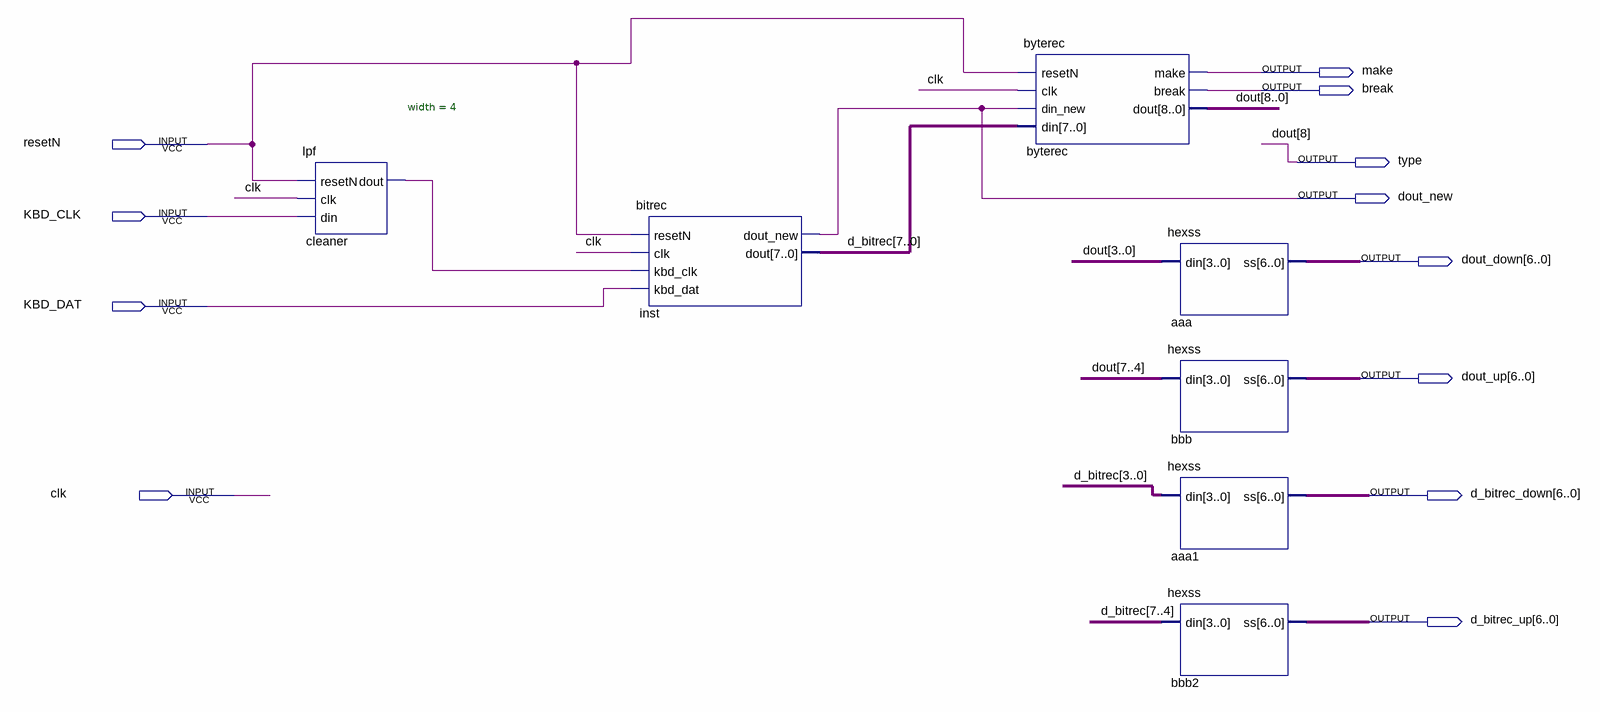
[diagram p0: schematic sheet]
// Quartus schematic KBDINTF.1.bdf as structural Verilog: 7 symbols, 12 pins
module \KBDINTF.1  (
  input  resetN,
  input  KBD_CLK,
  input  KBD_DAT,
  input  clk,
  output make,
  output \break ,
  output \type ,
  output dout_new,
  output [6:0] dout_down,
  output [6:0] dout_up,
  output [6:0] d_bitrec_down,
  output [6:0] d_bitrec_up
);

  wire cleaner_dout;
  wire [7:0] d_bitrec, dout;

  lpf #(.width(4)) cleaner (.resetN(resetN), .clk(clk), .din(KBD_CLK), .dout(cleaner_dout));
  bitrec inst (
    .resetN(resetN), .clk(clk), .kbd_clk(cleaner_dout), .kbd_dat(KBD_DAT), .dout_new(dout_new),
    .dout(d_bitrec));
  byterec byterec (
    .resetN(resetN), .clk(clk), .din_new(dout_new), .din(d_bitrec), .make(make), .\break (\break ),
    .dout({\type , dout}));
  hexss aaa (.din(dout[3:0]), .ss(dout_down));
  hexss bbb (.din(dout[7:4]), .ss(dout_up));
  hexss aaa1 (.din(d_bitrec[3:0]), .ss(d_bitrec_down));
  hexss bbb2 (.din(d_bitrec[7:4]), .ss(d_bitrec_up));

  // Other names for the same wires on the sheet: dout[8] = \type 
endmodule
